# Altium schematic sheet 02_Power.SchDoc
size B; SheetNumber: 2; SheetTotal: 6
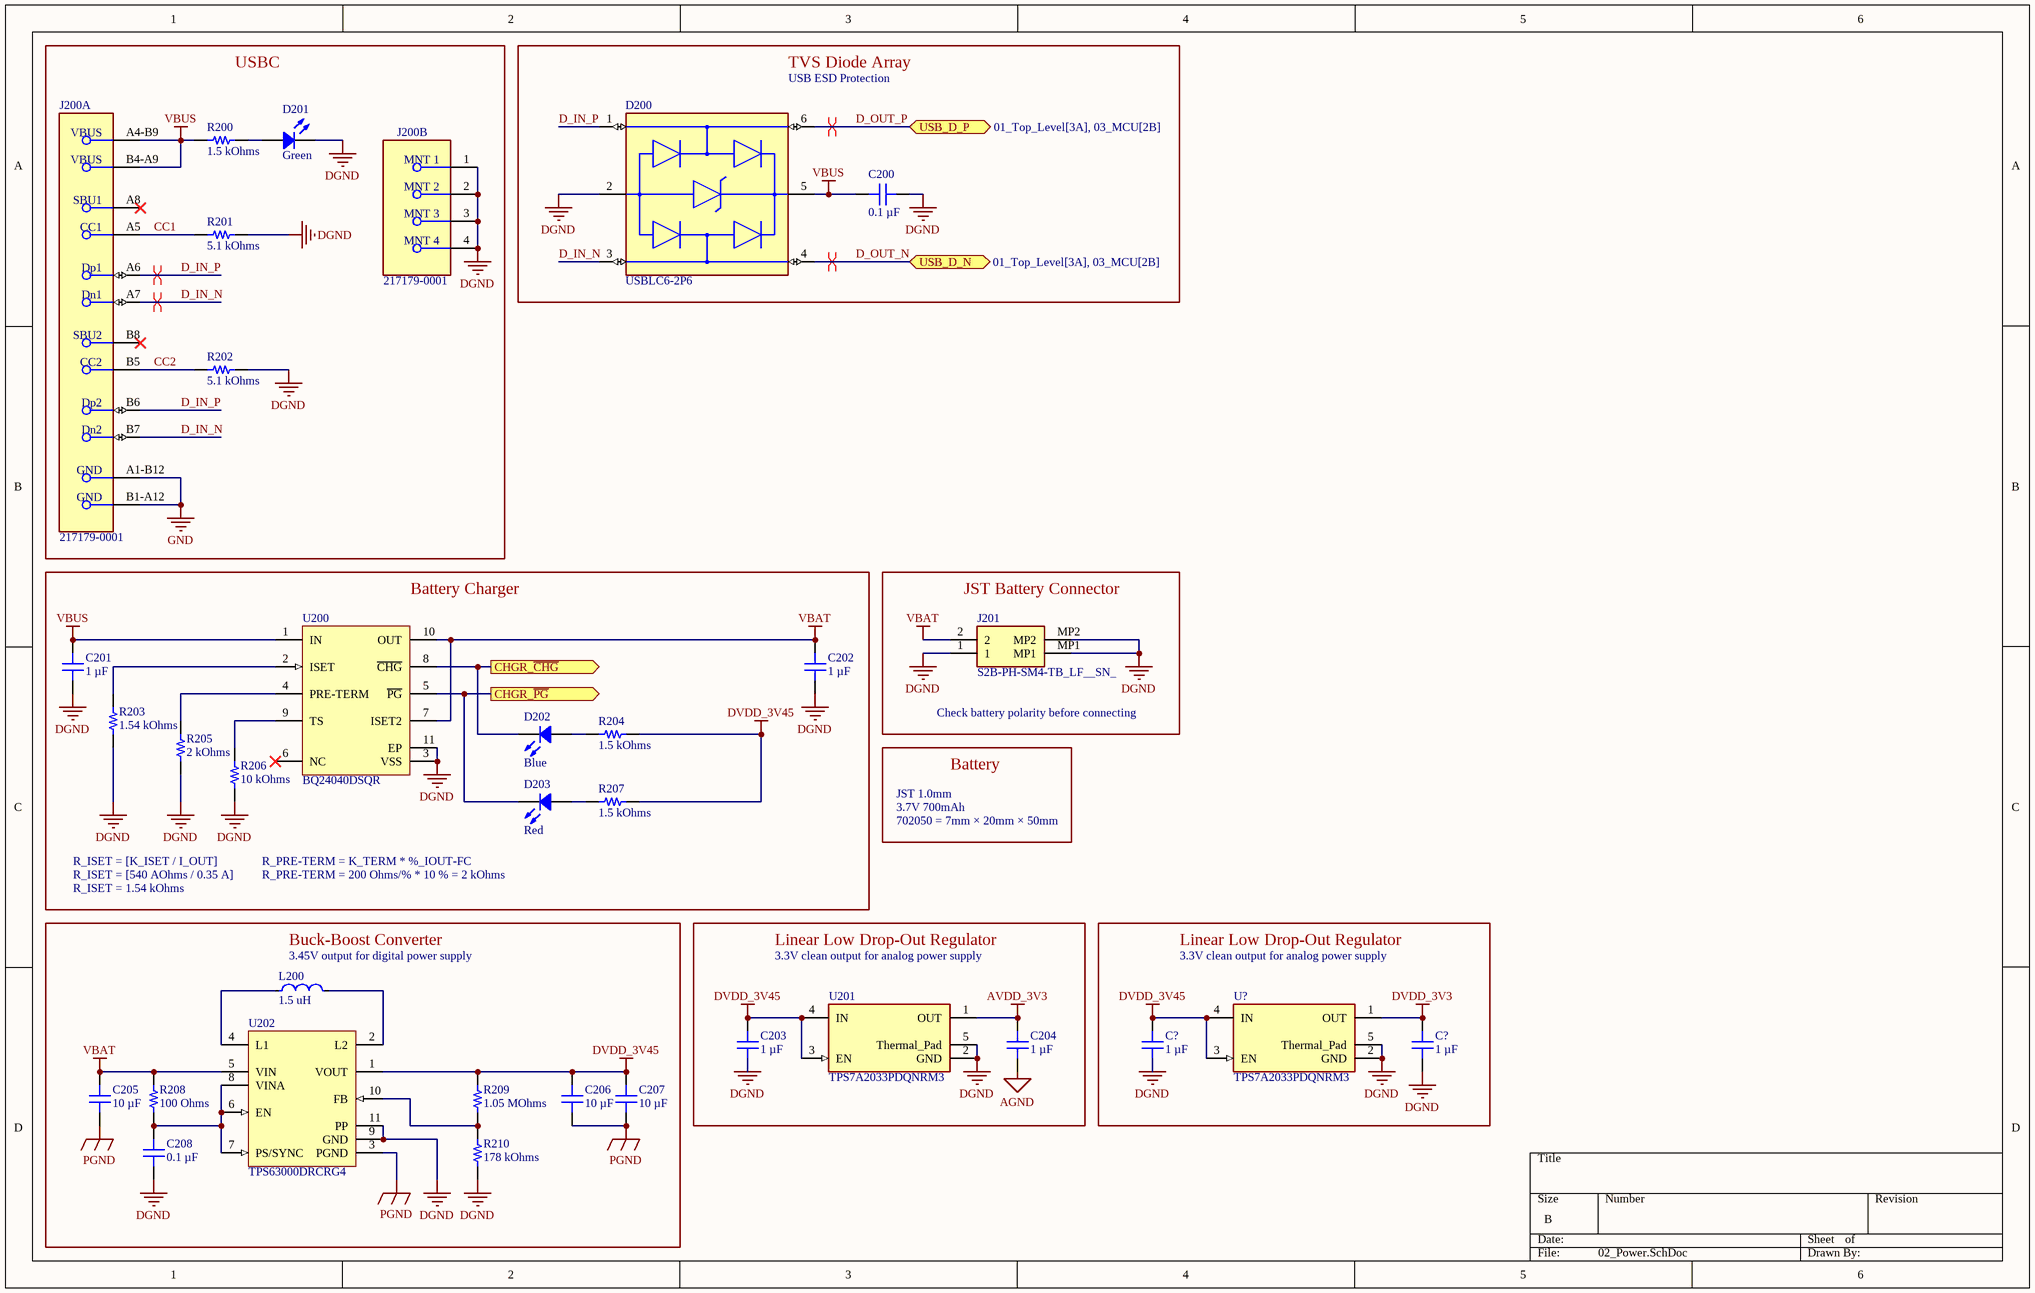
[diagram p0: 02_Power.SchDoc]

## Parts
(Parts that share a designator on the sheet are numbered #1, #2 ... from top to bottom, then left to right.)
C200  0.1 µF  [CAP 0402_1005]
C201  1 µF  [CAP 0402_1005]
C202  1 µF  [CAP 0402_1005]
C203  1 µF  [CAP 0402_1005]
C204  1 µF  [CAP 0402_1005]
C205  10 µF  [CAP 0603_1608]
C206  10 µF  [CAP 0603_1608]
C207  10 µF  [CAP 0603_1608]
C208  0.1 µF  [CAP 0402_1005]
C?#1  1 µF  [CAP 0402_1005]
C?#2  1 µF  [CAP 0402_1005]
D200  USBLC6-2P6  [FP-SOT-666-MFG]
D201  Green  [LED QTB IPC 0402_1005 GREEN]
D202  Blue  [LED QTB IPC 0402_1005 BLUE]
D203  Red  [LED QTB IPC 0402_1005 RED]
J200  217179-0001  [FP-2171790001-MFG]  (parts A,B of 2)
J201  S2B-PH-SM4-TB_LF__SN_  [S2BPHSM4TBLFSN]
L200  1.5 uH  [FP-LQH3NPN_JR-MFG]
R200  1.5 kOhms  [RES 0402_1005]
R201  5.1 kOhms  [RES 0402_1005]
R202  5.1 kOhms  [RES 0402_1005]
R203  1.54 kOhms  [RES 0402_1005]
R204  1.5 kOhms  [RES 0402_1005]
R205  2 kOhms  [RES 0402_1005]
R206  10 kOhms  [RES 0402_1005]
R207  1.5 kOhms  [RES 0402_1005]
R208  100 Ohms  [RES 0402_1005]
R209  1.05 MOhms  [RES 0402_1005]
R210  178 kOhms  [RES 0402_1005]
U200  BQ24040DSQR  [DSQ0010A_V]
U201  TPS7A2033PDQNRM3  [DQN0004A-MFG]
U202  TPS63000DRCRG4  [DRC10-2400X1650TP]
U?  TPS7A2033PDQNRM3  [DQN0004A-MFG]

## Blocks framed on the sheet
USBC: D201 J200 R200-R202
TVS Diode Array: C200 D200
Battery Charger: C201 C202 D202 D203 R203-R207 U200
JST Battery Connector: J201
Buck-Boost Converter: C205-C208 L200 R208-R210 U202
Linear Low Drop-Out Regulator: C203 C204 U201
Linear Low Drop-Out Regulator: C?#1 C?#2 U?

## Ports
CHGR_~{CHG} (out), CHGR_~{PG} (out), USB_D_N (bidir, see 01_Top_Level[3A], 03_MCU[2B]), USB_D_P (bidir, see 01_Top_Level[3A], 03_MCU[2B])

## Nets
AGND: C204.1
AVDD_3V3: C204.2 U201.1(OUT)
DGND: C200.2 C201.1 C202.1 C203.1 C208.1 C?#1.1 C?#2.1 D200.2(GND) D201.C J200.1(MNT_1) J200.2(MNT_2) J200.3(MNT_3) J200.4(MNT_4) J201.1 J201.MP1 J201.MP2 R201.1 R202.1 R203.1 R205.1 R206.1 R210.1 U200.3(VSS) U200.11(EP) U201.2(GND) U201.5(Thermal_Pad) U202.9(GND) U202.11(PP) U?.2(GND) U?.5(Thermal_Pad)
DVDD_3V3: C?#2.2 U?.1(OUT)
DVDD_3V45: C203.2 C206.2 C207.2 C?#1.2 R204.1 R207.1 R209.2 U201.3(EN) U201.4(IN) U202.1(VOUT) U?.3(EN) U?.4(IN)
GND: J200.A1-B12(GND) J200.B1-A12(GND)
PGND: C205.1 C206.1 C207.1 U202.3(PGND)
VBAT: C202.2 C205.2 J201.2 R208.2 U200.7(ISET2) U200.10(OUT) U202.5(VIN)
VBUS: C200.1 C201.2 D200.5(VBUS) J200.A4-B9(VBUS) J200.B4-A9(VBUS) R200.1 U200.1(IN)
CC1: J200.A5(CC1) R201.2
CC2: J200.B5(CC2) R202.2
CHGR_~{CHG}: D202.C U200.8(~{CHG}) ; port CHGR_~{CHG}
CHGR_~{PG}: D203.C U200.5(~{PG}) ; port CHGR_~{PG}
D_IN_N: D200.3(I/O2) J200.A7(Dn1) J200.B7(Dn2)
D_IN_P: D200.1(I/O1) J200.A6(Dp1) J200.B6(Dp2)
D_OUT_N: D200.4(I/O2) ; port USB_D_N
D_OUT_P: D200.6(I/O1) ; port USB_D_P
NetC208_2: C208.2 R208.1 U202.6(EN) U202.7(PS/SYNC) U202.8(VINA)
NetD201_A: D201.A R200.2
NetD202_A: D202.A R204.2
NetD203_A: D203.A R207.2
NetL200_1: L200.1 U202.4(L1)
NetL200_2: L200.2 U202.2(L2)
NetR203_2: R203.2 U200.2(ISET)
NetR205_2: R205.2 U200.4(PRE-TERM)
NetR206_2: R206.2 U200.9(TS)
NetR209_1: R209.1 R210.2 U202.10(FB)

Not connected (* = marked no-connect by the designer): J200 A8(SBU1)* B8(SBU2)*; U200 6(NC)*

## Layout directives
differential pair: D_IN_N, D_IN_P, D_OUT_N, D_OUT_P

## Notes on the sheet
- (near D200) USB ESD Protection
- Check battery polarity before connecting
- Battery
- 702050 = 7mm × 20mm × 50mm
- 3.7V 700mAh
- JST 1.0mm
- R_ISET = [K_ISET / I_OUT]
- R_ISET = [540 AOhms / 0.35 A]
- R_ISET = 1.54 kOhms
- R_PRE-TERM = K_TERM * %_IOUT-FC
- R_PRE-TERM = 200 Ohms/% * 10 % = 2 kOhms
- (near L200) 3.45V output for digital power supply
- 3.3V clean output for analog power supply

## Library data of the parts
C200 C208 = EMF105B7104KVHF: CAP CER 0.1UF 16V X7R 0402; manufacturer: Taiyo Yuden; Tolerance: ±10%; Part Number: EMF105B7104KVHF; Capacitance: 0.1 µF; Applications: Automotive, SMPS Filtering; componentlink1description: Datasheet; componentlink1url: https://ds.yuden.co.jp/TYCOMPAS/ut/detail?pn=EMF105B7104KVHF&u=M; componentlink2description: DigiKey Link; componentlink2url: https://www.digikey.com/en/products/detail/taiyo-yuden/EMF105B7104KVHF/10379129; Device Package: 0402 (1005 Metric); lastupdated: 4/6/2026 7:11:11 PM; Lifecycle Status: Active; Minimum Order: 1; Mounting Type: Surface Mount, MLCC; Operating Temperature: -55°C ~ 125°C; Package / Case: 0402 (1005 Metric); packaging: TapeAndReel; partid: 1868; Part Status: Active; price: 0.01; Ratings: AEC-Q200; series: M; Size / Dimension: 0.039" L x 0.020" W (1.00mm x 0.50mm); Supplier 1: DigiKey; Supplier Part Number 1: 587-6563-1-ND; Temperature Coefficient: X7R; Thickness (Max): 0.022" (0.55mm); value: 0.1 µF; Voltage - Rated: 16V
C201-C204 C?#1 C?#2 = GRM155R61C105MA12D: CAP CER 1UF 16V X5R 0402; manufacturer: Murata Electronics; Tolerance: ±20%; Part Number: GRM155R61C105MA12D; Capacitance: 1 µF; Applications: General Purpose; componentlink1description: Datasheet; componentlink1url: https://search.murata.co.jp/Ceramy/image/img/A01X/G101/ENG/GRM155R61C105MA12-01.pdf; componentlink2description: DigiKey Link; componentlink2url: https://www.digikey.com/en/products/detail/murata-electronics/GRM155R61C105MA12D/4905131; Device Package: 0402 (1005 Metric); lastupdated: 4/6/2026 7:10:35 PM; Lifecycle Status: Active; Minimum Order: 1; Mounting Type: Surface Mount, MLCC; Operating Temperature: -55°C ~ 85°C; Package / Case: 0402 (1005 Metric); packaging: TapeAndReel; partid: 10295; Part Status: Active; price: 0.01; series: GRM; Size / Dimension: 0.039" L x 0.020" W (1.00mm x 0.50mm); Supplier 1: DigiKey; Supplier Part Number 1: 490-14599-1-ND; Temperature Coefficient: X5R; Thickness (Max): 0.022" (0.55mm); value: 1 µF; Voltage - Rated: 16V
C205-C207 = GRM188R61A106ME69D: CAP CER 10UF 10V X5R 0603; manufacturer: Murata Electronics; Tolerance: ±20%; Part Number: GRM188R61A106ME69D; Capacitance: 10 µF; Applications: General Purpose; componentlink1description: Datasheet; componentlink1url: https://search.murata.co.jp/Ceramy/image/img/A01X/G101/ENG/GRM188R61A106ME69-01.pdf; componentlink2description: DigiKey Link; componentlink2url: https://www.digikey.com/en/products/detail/murata-electronics/GRM188R61A106ME69D/5027560; Device Package: 0603 (1608 Metric); lastupdated: 4/6/2026 7:23:20 PM; Lifecycle Status: Active; Minimum Order: 1; Mounting Type: Surface Mount, MLCC; Operating Temperature: -55°C ~ 85°C; Package / Case: 0603 (1608 Metric); packaging: TapeAndReel; partid: 11157; Part Status: Active; price: 0.01; series: GRM; Size / Dimension: 0.063" L x 0.031" W (1.60mm x 0.80mm); Supplier 1: DigiKey; Supplier Part Number 1: 490-10475-1-ND; Temperature Coefficient: X5R; Thickness (Max): 0.037" (0.95mm); value: 10 µF; Voltage - Rated: 10V
D200 = CMP-12225-000058-1: TVS DIODE 5.25V 17V SOT666; Min Breakdown Voltage: 6V; Power Line Protection: Yes; Element Configuration: Dual; Test Current: 1mA; Working Voltage: 5V; Number of Channels: 2; Max Reverse Leakage Current: 150nA; Direction: Unidirectional; Peak Pulse Current: 5A; Number of Elements: 1; Capacitance: 3.5pF; Max Breakdown Voltage: 6V; Height: 0.6mm; Depth: 1.3mm; Contact Plating: Tin; Reverse Breakdown Voltage: 6V; REACH SVHC: No SVHC; Operating Supply Voltage: 5V; Width: 1.3mm; Max Operating Temperature: 125°C; Reverse Standoff Voltage: 5V; ESD Protection: Yes; Package Quantity: 1; Termination: SMD/SMT; Length: 1.7mm; Leakage Current: 150nA; Number of Bidirectional Channels: 2; Case/Package: SOT-666; Min Operating Temperature: -40°C; Number of Pins: 6; Clamping Voltage: 17V; Breakdown Voltage: 6V; Lead Free: Lead Free; Radiation Hardening: No; Packaging: Tape and Reel; Mount: Surface Mount; Polarity: Unidirectional
D201 = QBLP595-IG: LED GREEN CLEAR 0402 SMD; Manufacturer: QT Brightek (QTB); Configuration: Standard; Current - Test: 20mA; Lens Color: Colorless; Lens Size: 0.70mm x 0.50mm; Lens Style: Rectangle with Flat Top; Millicandela Rating: 600mcd; Viewing Angle: 140°; Voltage - Forward (Vf) (Typ): 3.1V; Wavelength - Dominant: 520nm; Wavelength - Peak: 515nm; Part Number: QBLP595-IG; Color: Green; ComponentLink1Description: Datasheet; ComponentLink1URL: http://www.qt-brightek.com/datasheet/QBLP595 Series.pdf; ComponentLink2Description: DigiKey Link; ComponentLink2URL: https://www.digikey.com/en/products/detail/qt-brightek-qtb/QBLP595-IG/6201907; Device Package: 0402 (1005 Metric); Height (Max): 0.60mm; LastUpdated: 4/5/2026 9:26:25 PM; Lens Transparency: Clear; Lifecycle Status: Active; Minimum Order: 1; Mounting Type: Surface Mount; Package / Case: 0402 (1005 Metric); Packaging: TapeAndReel; PartId: 717; Part Status: Active; Price: 0.07; Series: QBLP595; Size / Dimension: 1.00mm L x 0.50mm W; Supplier 1: DigiKey; Supplier Part Number 1: 1516-1216-1-ND; Supplier Device Package: 0402; Value: Green
D202 = QBLP595-2IB: 0402 LED BLUE 465NM, CLEAR LENS,; Manufacturer: QT Brightek (QTB); Configuration: Standard; Current - Test: 20mA; Lens Color: Colorless; Lens Size: 0.70mm x 0.50mm; Lens Style: Rectangle with Flat Top; Millicandela Rating: 60mcd; Viewing Angle: 140°; Voltage - Forward (Vf) (Typ): 3.2V; Wavelength - Peak: 460nm; Part Number: QBLP595-2IB; Color: Blue; ComponentLink1Description: Datasheet; ComponentLink1URL: https://www.qt-brightek.com/datasheet/QBLP595-2IB.pdf; ComponentLink2Description: DigiKey Link; ComponentLink2URL: https://www.digikey.com/en/products/detail/qt-brightek-qtb/QBLP595-2IB/22106662; Device Package: 0402 (1005 Metric); Height (Max): 0.60mm; LastUpdated: 4/5/2026 9:26:28 PM; Lens Transparency: Clear; Lifecycle Status: Active; Minimum Order: 1; Mounting Type: Surface Mount; Package / Case: 0402 (1005 Metric); Packaging: TapeAndReel; PartId: 1426; Price: 0.07; Series: QBLP595; Size / Dimension: 1.00mm L x 0.50mm W; Supplier 1: DigiKey; Supplier Part Number 1: 1516-QBLP595-2IBCT-ND; Supplier Device Package: 0402; Value: Blue; Wavelength - Dominant: 465nm
D203 = QBLP595-R: LED RED CLEAR 0402 SMD; Manufacturer: QT Brightek (QTB); Configuration: Standard; Current - Test: 20mA; Lens Color: Colorless; Lens Size: 0.70mm x 0.50mm; Lens Style: Rectangle with Flat Top; Millicandela Rating: 120mcd; Viewing Angle: 140°; Voltage - Forward (Vf) (Typ): 2V; Wavelength - Dominant: 620nm; Wavelength - Peak: 628nm; Part Number: QBLP595-R; Color: Red; ComponentLink1Description: Datasheet; ComponentLink1URL: http://www.qt-brightek.com/datasheet/QBLP595 Series.pdf; ComponentLink2Description: DigiKey Link; ComponentLink2URL: https://www.digikey.com/en/products/detail/qt-brightek-qtb/QBLP595-R/6201908; Device Package: 0402 (1005 Metric); Height (Max): 0.60mm; LastUpdated: 4/5/2026 9:26:30 PM; Lens Transparency: Clear; Lifecycle Status: Active; Minimum Order: 1; Mounting Type: Surface Mount; Package / Case: 0402 (1005 Metric); Packaging: TapeAndReel; PartId: 513; Part Status: Active; Price: 0.06; Series: QBLP595; Size / Dimension: 1.00mm L x 0.50mm W; Supplier 1: DigiKey; Supplier Part Number 1: 1516-1217-1-ND; Supplier Device Package: 0402; Value: Red
J200 = CMP-04767-000028-2: CONN RCP USB2.0 TYP C 24P SMD RA; NexarPartId: 117190526; Gender: Receptacle; Number of Contacts: 16; Current Rating: 1.25A; Voltage Rating: 30V; Min Operating Temperature: -40°C; USB Standard: USB 2.0; Height: 3.36mm; Contact Material: Gold, Nickel; Max Operating Temperature: 85°C
J201 = S2B-PH-SM4-TB_LF__SN_: Connector; Manufacturer_Name: JST (JAPAN SOLDERLESS TERMINALS); Manufacturer_Part_Number: S2B-PH-SM4-TB(LF)(SN); Datasheet Link: https://www.jst-mfg.com/product/pdf/eng/ePH.pdf; Height: 6.6mm; Mouser Part Number: N/A; Mouser Price/Stock: https://www.mouser.co.uk/ProductDetail/JST-Commercial/S2B-PH-SM4-TBLFSN?qs=QpmGXVUTftEA9IU90i0xlg%3D%3D; Arrow Part Number: S2B-PH-SM4-TB(LF)(SN); Arrow Price/Stock: https://www.arrow.com/en/products/s2b-ph-sm4-tb-lf-sn/jst-manufacturing?utm_currency=USD&region=europe
L200 = CMP-06042-004536-1: Wire Wound Ferrite Inductor for Power Lines 1.5μH ±20% 0.0588Ω 2510mA 1212; Part Number: LQH3NPN1R5MJRL; DC Resistance (DCR): 58.8mR; Inductance: 1.5uH; Saturation Current: 1.95A; Current Rating: 1.1A; Shielding: Shielded; Self Resonant Frequency: 60MHz; Test Frequency: 1MHz; Tolerance: 20%; Length: 0.118inch; Resistor Type: Wirewound; Case Code (Imperial): 1212; Height - Seated (Max): 0.047inch; Mount: Surface Mount; Max Operating Temperature: 105°C; Width: 0.118inch; Core Material: Ferrite; Packaging: Tape and Reel; Case/Package: 1212; Case Code (Metric): 3030; Min Operating Temperature: -40°C
R200 R204 R207 = AC0402JR-071K5L: RES SMD 1.5K OHM 5% 1/16W 0402; Manufacturer: Yageo; Power (Watts): 0.063W, 1/16W; Temperature Coefficient: ±100ppm/°C; Part Number: AC0402JR-071K5L; Value: 1.5 kOhms; ComponentLink1Description: Datasheet; ComponentLink1URL: https://www.yageo.com/upload/media/product/productsearch/datasheet/rchip/PYu-AC_51_RoHS_L_7.pdf; ComponentLink2Description: DigiKey Link; ComponentLink2URL: https://www.digikey.com/en/products/detail/yageo/AC0402JR-071K5L/5895600; Composition: Thick Film; Device Package: 0402 (1005 Metric); Features: Automotive AEC-Q200, Moisture Resistant; Height - Seated (Max): 0.015" (0.37mm); LastUpdated: 4/6/2026 7:41:17 PM; Lifecycle Status: Active; Minimum Order: 1; Number of Terminations: 2; Operating Temperature: -55°C ~ 155°C; Package / Case: 0402 (1005 Metric); Packaging: CutTape; PartId: 3395; Part Status: Active; Price: 0.10; Ratings: AEC-Q200; Resistance: 1.5 kOhms; Series: AC; Size / Dimension: 0.039" L x 0.020" W (1.00mm x 0.50mm); Supplier 1: DigiKey; Supplier Part Number 1: YAG3523CT-ND; Supplier Device Package: 0402; Tolerance: ±5%
R201 R202 = RT0402BRE075K1L: RES SMD 5.1K OHM 0.1% 1/16W 0402; Manufacturer: Yageo; Power (Watts): 0.063W, 1/16W; Temperature Coefficient: ±50ppm/°C; Part Number: RT0402BRE075K1L; Value: 5.1 kOhms; ComponentLink1Description: Datasheet; ComponentLink1URL: https://www.yageo.com/upload/media/product/productsearch/datasheet/rchip/PYu-RT_1-to-0.01_RoHS_L_11.pdf; ComponentLink2Description: DigiKey Link; ComponentLink2URL: https://www.digikey.com/en/products/detail/yageo/RT0402BRE075K1L/1069792; Composition: Thin Film; Device Package: 0402 (1005 Metric); Height - Seated (Max): 0.014" (0.35mm); LastUpdated: 4/6/2026 7:41:16 PM; Lifecycle Status: Active; Minimum Order: 1; Number of Terminations: 2; Operating Temperature: -55°C ~ 155°C; Package / Case: 0402 (1005 Metric); Packaging: TapeAndReel; PartId: 4590; Part Status: Active; Price: 0.04; Resistance: 5.1 kOhms; Series: RT; Size / Dimension: 0.039" L x 0.020" W (1.00mm x 0.50mm); Supplier 1: DigiKey; Supplier Part Number 1: YAG4404CT-ND; Supplier Device Package: 0402; Tolerance: ±0.1%
R203 = AC0402FR-071K54L: RES SMD 1.54K OHM 1% 1/16W 0402; Manufacturer: Yageo; Power (Watts): 0.063W, 1/16W; Temperature Coefficient: ±100ppm/°C; Part Number: AC0402FR-071K54L; Value: 1.54 kOhms; ComponentLink1Description: Datasheet; ComponentLink1URL: https://www.yageo.com/upload/media/product/productsearch/datasheet/rchip/PYu-AC_51_RoHS_L_7.pdf; ComponentLink2Description: DigiKey Link; ComponentLink2URL: https://www.digikey.com/en/products/detail/yageo/AC0402FR-071K54L/5895142; Composition: Thick Film; Device Package: 0402 (1005 Metric); Features: Automotive AEC-Q200, Moisture Resistant; Height - Seated (Max): 0.015" (0.37mm); LastUpdated: 4/6/2026 7:41:14 PM; Lifecycle Status: Active; Minimum Order: 1; Number of Terminations: 2; Operating Temperature: -55°C ~ 155°C; Package / Case: 0402 (1005 Metric); Packaging: CutTape; PartId: 5260; Part Status: Active; Price: 0.01; Ratings: AEC-Q200; Resistance: 1.54 kOhms; Series: AC; Size / Dimension: 0.039" L x 0.020" W (1.00mm x 0.50mm); Supplier 1: DigiKey; Supplier Part Number 1: YAG5645CT-ND; Supplier Device Package: 0402; Tolerance: ±1%
R205 = RC0402FR-072KL: RES 2K OHM 1% 1/16W 0402; Manufacturer: Yageo; Power (Watts): 0.063W, 1/16W; Temperature Coefficient: ±100ppm/°C; Part Number: RC0402FR-072KL; Value: 2 kOhms; ComponentLink1Description: Datasheet; ComponentLink1URL: https://www.yageo.com/upload/media/product/productsearch/datasheet/rchip/PYu-RC_Group_51_RoHS_L_10.pdf; ComponentLink2Description: DigiKey Link; ComponentLink2URL: https://www.digikey.com/en/products/detail/yageo/RC0402FR-072KL/2827565; Composition: Thick Film; Device Package: 0402 (1005 Metric); Features: Moisture Resistant; Height - Seated (Max): 0.016" (0.40mm); LastUpdated: 4/6/2026 7:41:07 PM; Lifecycle Status: Active; Minimum Order: 1; Number of Terminations: 2; Operating Temperature: -55°C ~ 155°C; Package / Case: 0402 (1005 Metric); Packaging: CutTape; PartId: 17610; Part Status: Active; Price: 0.01; Resistance: 2 kOhms; Series: RC_L; Size / Dimension: 0.039" L x 0.020" W (1.00mm x 0.50mm); Supplier 1: DigiKey; Supplier Part Number 1: 311-2KLRCT-ND; Supplier Device Package: 0402; Tolerance: ±1%
R206 = CRCW040210K0FKEE: RES SMD 10K OHM 1% 1/16W 0402; Manufacturer: Vishay Dale; Power (Watts): 0.063W, 1/16W; Temperature Coefficient: ±100ppm/°C; Part Number: CRCW040210K0FKEE; Value: 10 kOhms; ComponentLink1Description: Datasheet; ComponentLink1URL: http://www.vishay.com/docs/20035/dcrcwe3.pdf; ComponentLink2Description: DigiKey Link; ComponentLink2URL: https://www.digikey.com/en/products/detail/vishay-dale/CRCW040210K0FKEE/5069897; Composition: Thick Film; Device Package: 0402 (1005 Metric); Features: Automotive AEC-Q200; Height - Seated (Max): 0.016" (0.40mm); LastUpdated: 2/9/2024 8:30:20 PM; Lifecycle Status: Active; Minimum Order: 1; Number of Terminations: 2; Operating Temperature: -55°C ~ 155°C; Package / Case: 0402 (1005 Metric); Packaging: CutTape; PartId: 3471; Part Status: Active; Price: 0.01; Ratings: AEC-Q200; Resistance: 10 kOhms; Series: CRCW; Size / Dimension: 0.039" L x 0.020" W (1.00mm x 0.50mm); Supplier 1: DigiKey; Supplier Part Number 1: 541-2954-1-ND; Supplier Device Package: 0402; Tolerance: ±1%
R208 = AC0402JR-07100RL: RES SMD 100 OHM 5% 1/16W 0402; Manufacturer: Yageo; Power (Watts): 0.063W, 1/16W; Temperature Coefficient: ±100ppm/°C; Part Number: AC0402JR-07100RL; Value: 100 Ohms; ComponentLink1Description: Datasheet; ComponentLink1URL: https://www.yageo.com/upload/media/product/productsearch/datasheet/rchip/PYu-AC_51_RoHS_L_7.pdf; ComponentLink2Description: DigiKey Link; ComponentLink2URL: https://www.digikey.com/en/products/detail/yageo/AC0402JR-07100RL/5895570; Composition: Thick Film; Device Package: 0402 (1005 Metric); Features: Automotive AEC-Q200, Moisture Resistant; Height - Seated (Max): 0.015" (0.37mm); LastUpdated: 4/6/2026 7:41:17 PM; Lifecycle Status: Active; Minimum Order: 1; Number of Terminations: 2; Operating Temperature: -55°C ~ 155°C; Package / Case: 0402 (1005 Metric); Packaging: CutTape; PartId: 3383; Part Status: Active; Price: 0.01; Ratings: AEC-Q200; Resistance: 100 Ohms; Series: AC; Size / Dimension: 0.039" L x 0.020" W (1.00mm x 0.50mm); Supplier 1: DigiKey; Supplier Part Number 1: YAG3516CT-ND; Supplier Device Package: 0402; Tolerance: ±5%
R209 = RMCF0402FT1M05: RES 1.05M OHM 1% 1/16W 0402; Manufacturer: Stackpole Electronics Inc; Power (Watts): 0.063W, 1/16W; Temperature Coefficient: ±200ppm/°C; Part Number: RMCF0402FT1M05; Value: 1.05 MOhms; ComponentLink1Description: Datasheet; ComponentLink1URL: https://www.seielect.com/catalog/sei-rmcf_rmcp.pdf; ComponentLink2Description: DigiKey Link; ComponentLink2URL: https://www.digikey.com/en/products/detail/stackpole-electronics-inc/RMCF0402FT1M05/1714314; Composition: Thick Film; Device Package: 0402 (1005 Metric); Features: Automotive AEC-Q200; Height - Seated (Max): 0.016" (0.40mm); LastUpdated: 2/9/2024 8:29:50 PM; Lifecycle Status: Active; Minimum Order: 1; Number of Terminations: 2; Operating Temperature: -55°C ~ 155°C; Package / Case: 0402 (1005 Metric); Packaging: CutTape; PartId: 11996; Part Status: Active; Price: 0.01; Ratings: AEC-Q200; Resistance: 1.05 MOhms; Series: RMCF; Size / Dimension: 0.039" L x 0.020" W (1.00mm x 0.50mm); Supplier 1: DigiKey; Supplier Part Number 1: RMCF0402FT1M05CT-ND; Supplier Device Package: 0402; Tolerance: ±1%
R210 = RMCF0402FT178K: RES 178K OHM 1% 1/16W 0402; Manufacturer: Stackpole Electronics Inc; Power (Watts): 0.063W, 1/16W; Temperature Coefficient: ±100ppm/°C; Part Number: RMCF0402FT178K; Value: 178 kOhms; ComponentLink1Description: Datasheet; ComponentLink1URL: https://www.seielect.com/catalog/sei-rmcf_rmcp.pdf; ComponentLink2Description: DigiKey Link; ComponentLink2URL: https://www.digikey.com/en/products/detail/stackpole-electronics-inc/RMCF0402FT178K/1714476; Composition: Thick Film; Device Package: 0402 (1005 Metric); Features: Automotive AEC-Q200; Height - Seated (Max): 0.016" (0.40mm); LastUpdated: 2/9/2024 8:29:45 PM; Lifecycle Status: Active; Minimum Order: 1; Number of Terminations: 2; Operating Temperature: -55°C ~ 155°C; Package / Case: 0402 (1005 Metric); Packaging: CutTape; PartId: 13591; Part Status: Active; Price: 0.01; Ratings: AEC-Q200; Resistance: 178 kOhms; Series: RMCF; Size / Dimension: 0.039" L x 0.020" W (1.00mm x 0.50mm); Supplier 1: DigiKey; Supplier Part Number 1: RMCF0402FT178KCT-ND; Supplier Device Package: 0402; Tolerance: ±1%
U200 = CMP-0321-00456-2: 800 mA, Single-Input, Single Cell Li-Ion Battery Charger with Auto Start. Vovp=6.6 V, 3.5 V, -40 to 85 degC, 10-pin SON (DSQ), Green (RoHS & no Sb/Br); Manufacturer: Texas Instruments; NiCd: N; Vin(Min)(V): 3.5; SubFamily: Battery Charge Management; PackageDescription: 10-Pin Plastic Small Outline No-Lead, 2 x 2 x 0.8 mm Body, 0.4 mm Pitch, Exposed Pad; PackageVersion: revB, Apr-2010; Mounting Technology: Surface Mount; Eco-Plan: Green (RoHS & no Sb/Br); ComponentLink1URL: http://www.ti.com/general/docs/lit/getliterature.tsp?genericPartNumber=BQ24040&fileType=pdf; PartNumber: BQ24040DSQR; DatasheetVersion: SLUS941A; Over Voltage Protection: N; PackageReference: DSQ0010A; NiMH: N; Li-Ion: N; Lead Acid: N; Li-Polymer: N; ComponentLink1Description: Datasheet
U201 U? = TPS7A2033PDQNRM3: 300mA ultra-low-noise low-IQ low-dropout (LDO) linear regulator with high PSRR 4-X2SON -40 to 125; Manufacturer_Name: Texas Instruments; TYPE: TYPE; RefDes: RefDes; Copyright: Copyright (C) 2026 Ultra Librarian. All rights reserved.; Manufacturer_Part_Number: TPS7A2033PDQNRM3
U202 = CMP-0349-00001-1: Buck-Boost Voltage Converter with 1.8 to 5.5 V Input and 1.2 to 5.5 V Output, -40 to 85 degC, 10-Pin SON (DRC), Green (RoHS & no Sb/Br); Manufacturer: Texas Instruments; Switching Frequency(Max)(kHz): 1500; Vout(Min)(V): 1.2; Vout(Max)(V): 5.5; SubFamily: Buck-Boost Regulator; Regulated Outputs(#): 1; Synchronous Rectification: TRUE; Iq(Typ)(mA): 0.04; Vin(Min)(V): 1.8; PackageReference: DRC10-2400X1650TP; ComponentLink2Description: Package Specification; ComponentLink1URL: http://www.ti.com/general/docs/lit/getliterature.tsp?genericPartNumber=TPS63000&fileType=pdf; Mounting Technology: Surface Mount; Topology: Buck-Boost; PackageVersion: revL, Sep-2011; Eco-Plan: Green (RoHS & no Sb/Br); ComponentLink1Description: Datasheet; Iout(Max)(A): 1.2; Vin(Max)(V): 5.5; DatasheetVersion: SLVS520B; PackageDescription: 10-Pin Plastic Small Outline No-Lead, 3 x 3 x 1 mm Body, 0.5 mm Pitch, Exposed Pad; ComponentLink2URL: http://www.ti.com/litv/pdf/mpds117k; PartNumber: TPS63000DRCRG4; Dynamic Voltage Scaling: TRUE